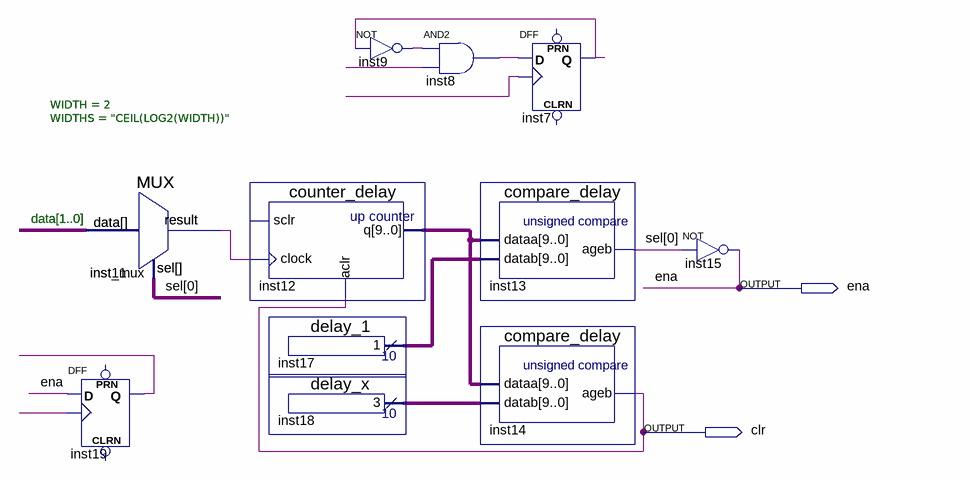
[diagram p0: schematic sheet]
// Quartus schematic trash.bdf as structural Verilog: 12 symbols, 2 pins
module trash (
  output ena,
  output clr
);

  wire inst7_q, inst8_out, inst9_out, inst11_result, inst19_q, undriven, undriven_2, undriven_3;
  wire [0:0] sel;
  wire [1:0] data;
  wire [9:0] inst12_q, inst17_result, inst18_result;

  MUX #(.WIDTH(2), .WIDTHS("CEIL(LOG2(WIDTH))")) inst11 (.data(data), .sel(sel[0]), .result(inst11_result));
  MUX #(.WIDTH(2), .WIDTHS("CEIL(LOG2(WIDTH))")) inst_mux (.data(data), .sel(sel[0]), .result(inst11_result));
  DFF inst19 (.CLK(undriven), .D(ena), .Q(inst19_q));  // open: CLRN, PRN
  counter_delay inst12 (.clock(inst11_result), .aclr(clr), .q(inst12_q));  // open: sclr
  delay_1 inst17 (.result(inst17_result));
  delay_x inst18 (.result(inst18_result));
  not inst9 (inst9_out, inst7_q);
  and inst8 (inst8_out, inst9_out, undriven_3);
  DFF inst7 (.CLK(undriven_2), .D(inst8_out), .Q(inst7_q));  // open: CLRN, PRN
  compare_delay inst13 (.dataa(inst12_q), .datab(inst17_result), .ageb(sel[0]));
  compare_delay inst14 (.dataa(inst12_q), .datab(inst18_result), .ageb(clr));
  not inst15 (ena, sel[0]);

  // Notes on the sheet:
  //   data[1..0]
endmodule
